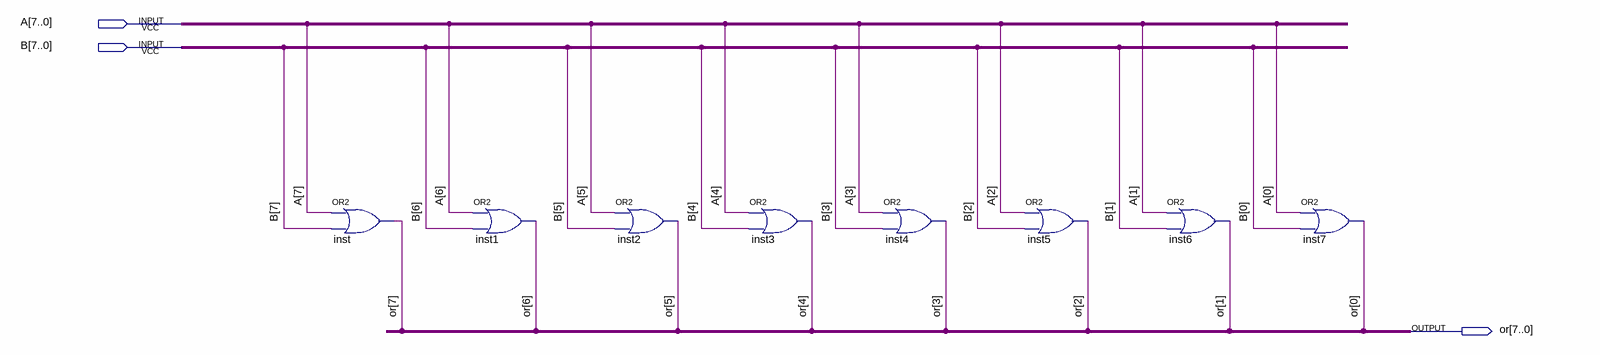
[diagram p0: schematic sheet]
// Quartus schematic or_logic_8bit.bdf as structural Verilog: 8 symbols, 3 pins
module or_logic_8bit (
  input  [7:0] A,
  input  [7:0] B,
  output [7:0] \or 
);

  or inst (\or [7], A[7], B[7]);
  or inst1 (\or [6], A[6], B[6]);
  or inst2 (\or [5], A[5], B[5]);
  or inst3 (\or [4], A[4], B[4]);
  or inst4 (\or [3], A[3], B[3]);
  or inst5 (\or [2], A[2], B[2]);
  or inst6 (\or [1], A[1], B[1]);
  or inst7 (\or [0], A[0], B[0]);
endmodule
